# EAGLE schematic Distortion board (EAGLE 9.0.0)
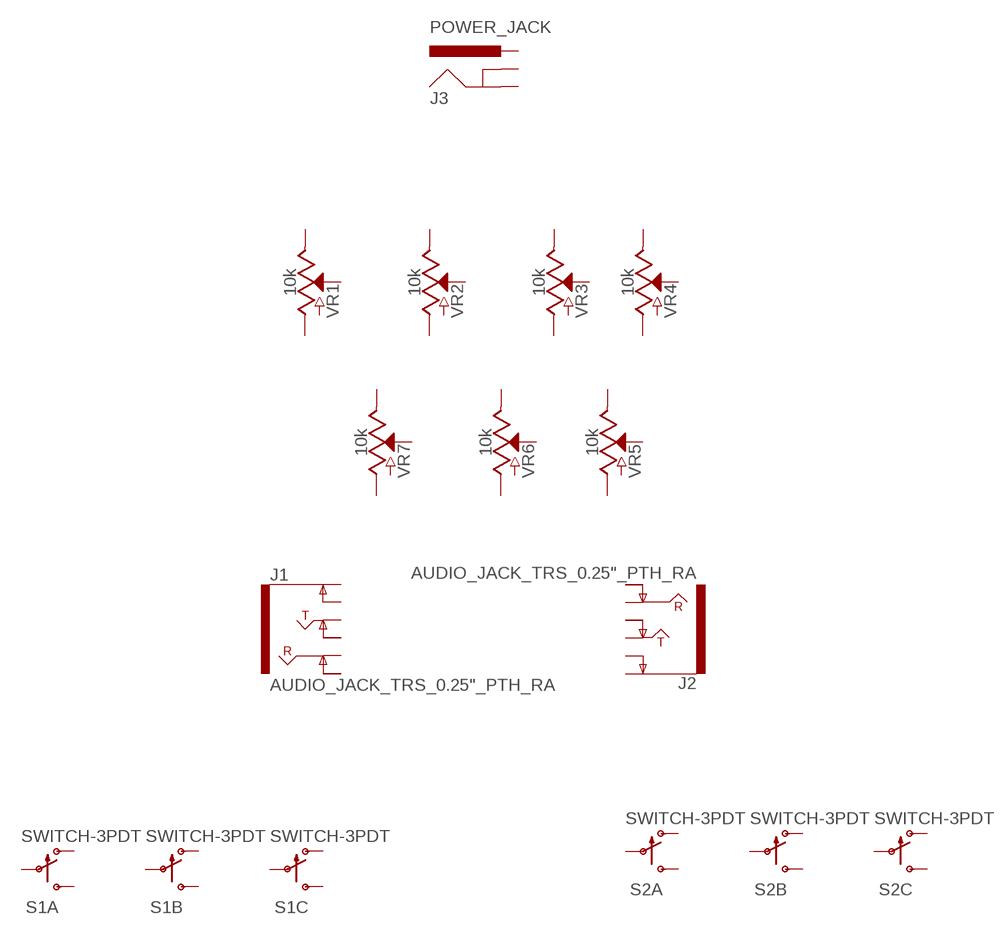
[diagram p0: schematic, sheet 1]

## Parts
J1  AUDIO_JACK_TRS_0.25"_PTH_RA  [AUDIO_JACK_0.25"_TRS_PTH_RA]
J2  AUDIO_JACK_TRS_0.25"_PTH_RA  [AUDIO_JACK_0.25"_TRS_PTH_RA]
J3  POWER_JACK  [POWER_JACK_PTH]
S1  SWITCH-3PDT  [STOMP-SWITCH-3PDT]
S2  SWITCH-3PDT  [STOMP-SWITCH-3PDT]
VR1  10k  POTENTIOMETER-PTH-9MM-1/20W-20%  [POT-PTH-ALPS]
VR2  10k  POTENTIOMETER-PTH-9MM-1/20W-20%  [POT-PTH-ALPS]
VR3  10k  POTENTIOMETER-PTH-9MM-1/20W-20%  [POT-PTH-ALPS]
VR4  10k  POTENTIOMETER-PTH-9MM-1/20W-20%  [POT-PTH-ALPS]
VR5  10k  POTENTIOMETER-PTH-9MM-1/20W-20%  [POT-PTH-ALPS]
VR6  10k  POTENTIOMETER-PTH-9MM-1/20W-20%  [POT-PTH-ALPS]
VR7  10k  POTENTIOMETER-PTH-9MM-1/20W-20%  [POT-PTH-ALPS]
Unconnected: J1.RING J1.RING-NORM J1.SLEEVE(EARTH) J1.SLEEVE-NORM(EARTH-NORM) J1.TIP J1.TIP-NORM J2.RING J2.RING-NORM J2.SLEEVE(EARTH) J2.SLEEVE-NORM(EARTH-NORM) J2.TIP J2.TIP-NORM J3.GND J3.GNDBREAK J3.PWR S1.P$1(A:O) S1.P$2(A:P) S1.P$3(A:S) S1.P$4(B:O) S1.P$5(B:P) S1.P$6(B:S) S1.P$7(C:O) S1.P$8(C:P) S1.P$9(C:S) S2.P$1(A:O) S2.P$2(A:P) S2.P$3(A:S) S2.P$4(B:O) S2.P$5(B:P) S2.P$6(B:S) S2.P$7(C:O) S2.P$8(C:P) S2.P$9(C:S) VR1.P$1(E) VR1.P$2(S) VR1.P$3(A) VR2.P$1(E) VR2.P$2(S) VR2.P$3(A) VR3.P$1(E) VR3.P$2(S) VR3.P$3(A) VR4.P$1(E) VR4.P$2(S) VR4.P$3(A) VR5.P$1(E) VR5.P$2(S) VR5.P$3(A) VR6.P$1(E) VR6.P$2(S) VR6.P$3(A) VR7.P$1(E) VR7.P$2(S) VR7.P$3(A)

## Library data of the parts
J1 J2 = SparkFun-Connectors:AUDIO_JACK_TRS_0.25"_PTH_RA: Audio Jack, 1/4" TRS jack, horizontal, PTH, aka "Phono jack" Find the connector here: Audio Jack - 1/4" Stereo (right angle) <https://www.sparkfun.com/products/11144> (COM-11144) Datasheet <http://cdn.sparkfun.com/datasheets/Components/General/JP-611%20DD.jpg> Note, although the datasheet and physical part are slightly different, this footprint was proven to mate well on the Proto Pedal. This device is used on these SparkFun Products: SparkFun TRS Jack Breakout - 1/4" Stereo <https://www.sparkfun.com/products/13005> (BOB-13005 ) SparkFun Proto Pedal - sorry bad link - product comming soon! <https://www.sparkfun.com/products/13124> (PRT-13124); PROD_ID: CONN-12339; SF_ID: COM-11144
J3 = SparkFun-Connectors:POWER_JACK: Power Jack Connector This is the standard 5.5mm barrel jack for power. The PTH is the most common, proven, reliable, footprint. The Slot footprint only works if the mill layer is transmitted to the PCB fab house so be warned. Here are the connectors we sell at SparkFun: DC Barrel Power Jack/Connector <https://www.sparkfun.com/products/119> (PRT-00119) DC Barrel Power Jack/Connector (SMD) <https://www.sparkfun.com/products/12748> (PRT-12748) DC Barrel Jack Adapter - Breadboard Compatible <https://www.sparkfun.com/products/10811> (PRT-10811) It is used on this SparkFun product (and many, many others): SparkFun RedBoard - Programmed with Arduino <https://www.sparkfun.com/products/12757> (DEV-12757) Also, if you need a mating power supply or connector, please check these out: Wall Adapter Power Supply - 9VDC 650mA <https://www.sparkfun.com/products/298> (TOL-00298) DC Barrel Jack Adapter - Male <https://www.sparkfun.com/products/10287> (PRT-10287); PROD_ID: CONN-08197; SPICEPREFIX: J
S1 S2 = SparkFun-Electromechanical:SWITCH-3PDT: Three-pole, double-throw stomp switch. Drawn as three separate gates for schematic clarity.; PROD_ID: SWCH-13197
VR1-VR7 = SparkFun-Resistors:POTENTIOMETER: Potentiometer (Pot) Three-terminal potentiometers, with an adjustable wiper and two adjustable resistors. A pot can be used to create a configurable voltage divider, or as a variable resistor. Variants ALPS_POT and ALPS_POT_KIT - PTH, breadboard compatible, 9mm square pots Rotary Potentiometer - Linear (10k ohm) <https://www.sparkfun.com/products/9288> (COM-09288) The KIT variant exposes copper on only one side of the PTH pad, so the part can only be assembled on one side of the PCB. Useful for beginner soldering kits.; PROD_ID: RES-09177; SF_SKU: COM-09288